# Altium schematic sheet X7A15T-Fabric.SchDoc: X7A15T-Fabric
size A3; Organization: Semi-ATE; SheetNumber: 4; SheetTotal: 7; Date: JUN 2020; ApprovedBy: Hören; CheckedBy: Mörz; Author: Hören; DrawnBy: Rudziński; Engineer: Hören
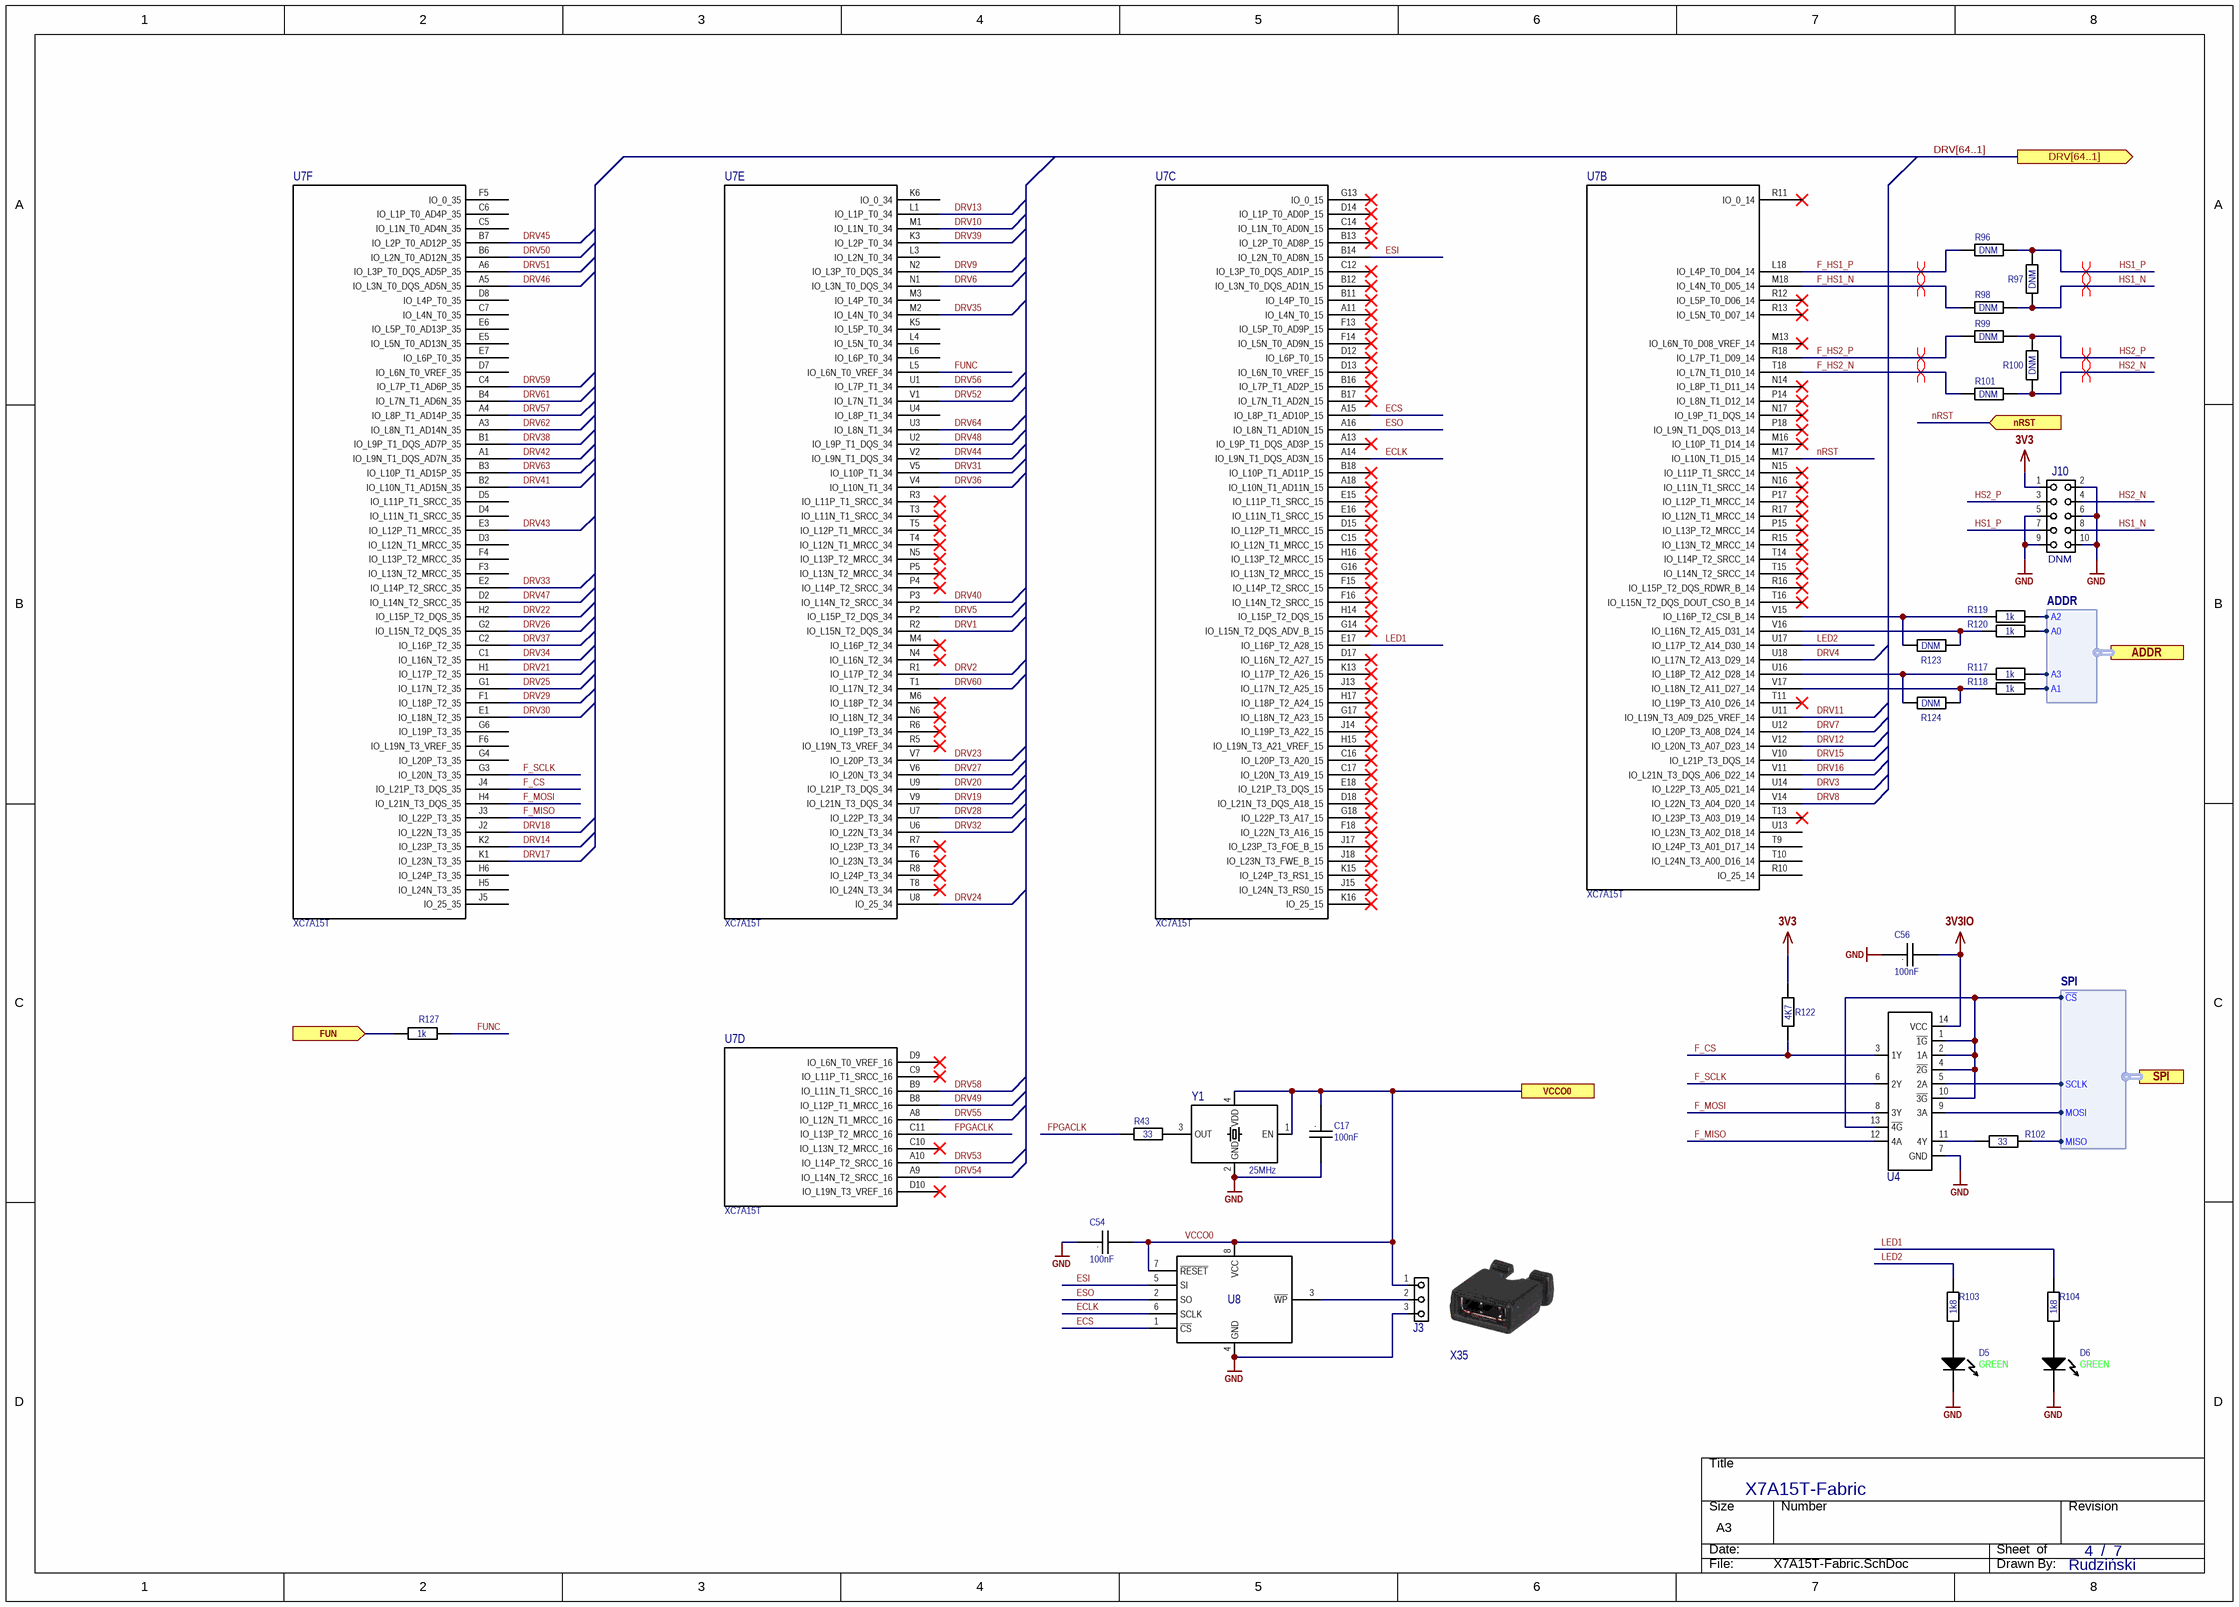
[diagram p0: X7A15T-Fabric.SchDoc]

## Parts
C17  value 100nF  [C0402 Reflow]  (hidden comment: C)
C54  value 100nF  [C0402 Reflow]  (hidden comment: C)
C56  value 100nF  [C0402 Reflow]  (hidden comment: C)
D5  Color: GREEN  [L0603G]  (hidden comment: D)
D6  Color: GREEN  [L0603G]  (hidden comment: D)
J3  J  [Header 100mil 3x1]  (value not drawn)
J10  NicName: DNM  [Header 100mil 5x2]  (hidden comment: J)  (no BOM)
R43  value 33  [R0402 Reflow]  (hidden comment: R)
R96  value DNM  [R0402 Reflow]  (hidden comment: R)  (no BOM)
R97  value DNM  [R0402 Reflow]  (hidden comment: R)  (no BOM)
R98  value DNM  [R0402 Reflow]  (hidden comment: R)  (no BOM)
R99  value DNM  [R0402 Reflow]  (hidden comment: R)  (no BOM)
R100  value DNM  [R0402 Reflow]  (hidden comment: R)  (no BOM)
R101  value DNM  [R0402 Reflow]  (hidden comment: R)  (no BOM)
R102  value 33  [R0402 Reflow]  (hidden comment: R)
R103  value 1k8  [R0603 Reflow]  (hidden comment: R)
R104  value 1k8  [R0603 Reflow]  (hidden comment: R)
R117  value 1k  [R0402 Reflow]  (hidden comment: R)
R118  value 1k  [R0402 Reflow]  (hidden comment: R)
R119  value 1k  [R0402 Reflow]  (hidden comment: R)
R120  value 1k  [R0402 Reflow]  (hidden comment: R)
R122  value 4K7  [R0402 Reflow]  (hidden comment: R)
R123  value DNM  [R0402 Reflow]  (hidden comment: R)  (no BOM)
R124  value DNM  [R0402 Reflow]  (hidden comment: R)  (no BOM)
R127  value 1k  [R0402 Reflow]  (hidden comment: R)
U4  U  [TSSOP14]  (value not drawn)
U7  NicName: XC7A15T  [XC7A15T-1CSG324C]  (hidden comment: U)  (parts B,C,D,E,F of 8)
U8  U  [SOIC8 (R-8)]  (value not drawn)
X35  X  (value not drawn)
Y1  Frequency: 25MHz  [4SMD]  (hidden comment: Y)

## Ports
ADDR (harness ADDR), DRV[64..1] (out), FUN (in), nRST (in), SPI (harness SPI), VCCO0

## Harnesses
SPI: MISO, MOSI, SCLK, ~{CS}
ADDR: A3, A2, A1, A0

## Nets
3V3: J10.1 R122.2
3V3IO: C56.2 U4.14(VCC)
GND: C17.2 C54.1 C56.1 D5.2(Cathode) D6.2(Cathode) J3.3 J10.2 J10.5 J10.6 J10.9 J10.10 U4.7(GND) U8.4(GND) Y1.2(GND)
DRV1: U7.R2(IO_L15N_T2_DQS_34)
DRV2: U7.R1(IO_L17P_T2_34)
DRV3: U7.U14(IO_L22P_T3_A05_D21_14)
DRV4: U7.U18(IO_L17N_T2_A13_D29_14)
DRV5: U7.P2(IO_L15P_T2_DQS_34)
DRV6: U7.N1(IO_L3N_T0_DQS_34)
DRV7: U7.U12(IO_L20P_T3_A08_D24_14)
DRV8: U7.V14(IO_L22N_T3_A04_D20_14)
DRV9: U7.N2(IO_L3P_T0_DQS_34)
DRV10: U7.M1(IO_L1N_T0_34)
DRV11: U7.U11(IO_L19N_T3_A09_D25_VREF_14)
DRV12: U7.V12(IO_L20N_T3_A07_D23_14)
DRV13: U7.L1(IO_L1P_T0_34)
DRV14: U7.K2(IO_L23P_T3_35)
DRV15: U7.V10(IO_L21P_T3_DQS_14)
DRV16: U7.V11(IO_L21N_T3_DQS_A06_D22_14)
DRV17: U7.K1(IO_L23N_T3_35)
DRV18: U7.J2(IO_L22N_T3_35)
DRV19: U7.V9(IO_L21N_T3_DQS_34)
DRV20: U7.U9(IO_L21P_T3_DQS_34)
DRV21: U7.H1(IO_L17P_T2_35)
DRV22: U7.H2(IO_L15P_T2_DQS_35)
DRV23: U7.V7(IO_L20P_T3_34)
DRV24: U7.U8(IO_25_34)
DRV25: U7.G1(IO_L17N_T2_35)
DRV26: U7.G2(IO_L15N_T2_DQS_35)
DRV27: U7.V6(IO_L20N_T3_34)
DRV28: U7.U7(IO_L22P_T3_34)
DRV29: U7.F1(IO_L18P_T2_35)
DRV30: U7.E1(IO_L18N_T2_35)
DRV31: U7.V5(IO_L10P_T1_34)
DRV32: U7.U6(IO_L22N_T3_34)
DRV33: U7.E2(IO_L14P_T2_SRCC_35)
DRV34: U7.C1(IO_L16N_T2_35)
DRV35: U7.M2(IO_L4N_T0_34)
DRV36: U7.V4(IO_L10N_T1_34)
DRV37: U7.C2(IO_L16P_T2_35)
DRV38: U7.B1(IO_L9P_T1_DQS_AD7P_35)
DRV39: U7.K3(IO_L2P_T0_34)
DRV40: U7.P3(IO_L14N_T2_SRCC_34)
DRV41: U7.B2(IO_L10N_T1_AD15N_35)
DRV42: U7.A1(IO_L9N_T1_DQS_AD7N_35)
DRV43: U7.E3(IO_L12P_T1_MRCC_35)
DRV44: U7.V2(IO_L9N_T1_DQS_34)
DRV45: U7.B7(IO_L2P_T0_AD12P_35)
DRV46: U7.A5(IO_L3N_T0_DQS_AD5N_35)
DRV47: U7.D2(IO_L14N_T2_SRCC_35)
DRV48: U7.U2(IO_L9P_T1_DQS_34)
DRV49: U7.B8(IO_L12P_T1_MRCC_16)
DRV50: U7.B6(IO_L2N_T0_AD12N_35)
DRV51: U7.A6(IO_L3P_T0_DQS_AD5P_35)
DRV52: U7.V1(IO_L7N_T1_34)
DRV53: U7.A10(IO_L14P_T2_SRCC_16)
DRV54: U7.A9(IO_L14N_T2_SRCC_16)
DRV55: U7.A8(IO_L12N_T1_MRCC_16)
DRV56: U7.U1(IO_L7P_T1_34)
DRV57: U7.A4(IO_L8P_T1_AD14P_35)
DRV58: U7.B9(IO_L11N_T1_SRCC_16)
DRV59: U7.C4(IO_L7P_T1_AD6P_35)
DRV60: U7.T1(IO_L17N_T2_34)
DRV61: U7.B4(IO_L7N_T1_AD6N_35)
DRV62: U7.A3(IO_L8N_T1_AD14N_35)
DRV63: U7.B3(IO_L10P_T1_AD15P_35)
DRV64: U7.U3(IO_L8N_T1_34)
ECLK: U7.A14(IO_L9N_T1_DQS_AD3N_15) U8.6(SCLK)
ECS: U7.A15(IO_L8P_T1_AD10P_15) U8.1(~{CS})
ESI: U7.B14(IO_L2N_T0_AD8N_15) U8.5(SI)
ESO: U7.A16(IO_L8N_T1_AD10N_15) U8.2(SO)
F_CS: R122.1 U4.3(1Y) U7.J4(IO_L21P_T3_DQS_35)
F_HS1_N: R98.1 U7.M18(IO_L4N_T0_D05_14)
F_HS1_P: R96.1 U7.L18(IO_L4P_T0_D04_14)
F_HS2_N: R101.1 U7.T18(IO_L7N_T1_D10_14)
F_HS2_P: R99.1 U7.R18(IO_L7P_T1_D09_14)
F_MISO: U4.12(4A) U7.J3(IO_L22P_T3_35)
F_MOSI: U4.8(3Y) U7.H4(IO_L21N_T3_DQS_35)
F_SCLK: U4.6(2Y) U7.G3(IO_L20N_T3_35)
FPGACLK: R43.2 U7.C11(IO_L13P_T2_MRCC_16)
FUN: R127.1 ; port FUN
FUNC: R127.2 U7.L5(IO_L6N_T0_VREF_34)
HS1_N: J10.8 R97.1 R98.2
HS1_P: J10.7 R96.2 R97.2
HS2_N: J10.4 R100.1 R101.2
HS2_P: J10.3 R99.2 R100.2
LED1: R104.2 U7.E17(IO_L16P_T2_A28_15)
LED2: R103.2 U7.U17(IO_L17P_T2_A14_D30_14)
nRST: U7.M17(IO_L10N_T1_D15_14) ; port nRST
VCCO0: C17.1 C54.2 J3.1 U8.7(~{RESET}) U8.8(VCC) Y1.1(EN) Y1.4(VDD) ; port VCCO0
NetD5_1: D5.1(Anode) R103.1
NetD6_1: D6.1(Anode) R104.1
NetJ3_2: J3.2 U8.3(~{WP})
NetR43_1: R43.1 Y1.3(OUT)
NetR102_1: R102.1 ; port SPI.MISO
NetR102_2: R102.2 U4.11(4Y)
NetR117_1: R117.1 R124.1 U7.U16(IO_L18P_T2_A12_D28_14)
NetR117_2: R117.2 ; port ADDR.A3
NetR118_1: R118.1 R124.2 U7.V17(IO_L18N_T2_A11_D27_14)
NetR118_2: R118.2 ; port ADDR.A1
NetR119_1: R119.1 R123.1 U7.V15(IO_L16P_T2_CSI_B_14)
NetR119_2: R119.2 ; port ADDR.A2
NetR120_1: R120.1 R123.2 U7.V16(IO_L16N_T2_A15_D31_14)
NetR120_2: R120.2 ; port ADDR.A0
NetU4_1: U4.1(~{1G}) U4.2(1A) U4.4(~{2G}) U4.10(~{3G}) U4.13(~{4G}) ; port SPI.~{CS}
NetU4_5: U4.5(2A) ; port SPI.SCLK
NetU4_9: U4.9(3A) ; port SPI.MOSI

Not connected (* = marked no-connect by the designer): U7 A11(IO_L4N_T0_15)* A13(IO_L9P_T1_DQS_AD3P_15)* A18(IO_L10N_T1_AD11N_15)* B11(IO_L4P_T0_15)* B12(IO_L3N_T0_DQS_AD1N_15)* B13(IO_L2P_T0_AD8P_15)* B16(IO_L7P_T1_AD2P_15)* B17(IO_L7N_T1_AD2N_15)* B18(IO_L10P_T1_AD11P_15)* C5(IO_L1N_T0_AD4N_35) C6(IO_L1P_T0_AD4P_35) C7(IO_L4N_T0_35) C9(IO_L11P_T1_SRCC_16)* C10(IO_L13N_T2_MRCC_16)* C12(IO_L3P_T0_DQS_AD1P_15)* C14(IO_L1N_T0_AD0N_15)* C15(IO_L12N_T1_MRCC_15)* C16(IO_L20P_T3_A20_15)* C17(IO_L20N_T3_A19_15)* D3(IO_L12N_T1_MRCC_35) D4(IO_L11N_T1_SRCC_35) D5(IO_L11P_T1_SRCC_35) D7(IO_L6N_T0_VREF_35) D8(IO_L4P_T0_35) D9(IO_L6N_T0_VREF_16)* D10(IO_L19N_T3_VREF_16)* D12(IO_L6P_T0_15)* D13(IO_L6N_T0_VREF_15)* D14(IO_L1P_T0_AD0P_15)* D15(IO_L12P_T1_MRCC_15)* D17(IO_L16N_T2_A27_15)* D18(IO_L21N_T3_DQS_A18_15)* E5(IO_L5N_T0_AD13N_35) E6(IO_L5P_T0_AD13P_35) E7(IO_L6P_T0_35) E15(IO_L11P_T1_SRCC_15)* E16(IO_L11N_T1_SRCC_15)* E18(IO_L21P_T3_DQS_15)* F3(IO_L13N_T2_MRCC_35) F4(IO_L13P_T2_MRCC_35) F5(IO_0_35) F6(IO_L19N_T3_VREF_35) F13(IO_L5P_T0_AD9P_15)* F14(IO_L5N_T0_AD9N_15)* F15(IO_L14P_T2_SRCC_15)* F16(IO_L14N_T2_SRCC_15)* F18(IO_L22N_T3_A16_15)* G4(IO_L20P_T3_35) G6(IO_L19P_T3_35) G13(IO_0_15)* G14(IO_L15N_T2_DQS_ADV_B_15)* G16(IO_L13N_T2_MRCC_15)* G17(IO_L18N_T2_A23_15)* G18(IO_L22P_T3_A17_15)* H5(IO_L24N_T3_35) H6(IO_L24P_T3_35) H14(IO_L15P_T2_DQS_15)* H15(IO_L19N_T3_A21_VREF_15)* H16(IO_L13P_T2_MRCC_15)* H17(IO_L18P_T2_A24_15)* J5(IO_25_35) J13(IO_L17N_T2_A25_15)* J14(IO_L19P_T3_A22_15)* J15(IO_L24N_T3_RS0_15)* J17(IO_L23P_T3_FOE_B_15)* J18(IO_L23N_T3_FWE_B_15)* K5(IO_L5P_T0_34) K6(IO_0_34) K13(IO_L17P_T2_A26_15)* K15(IO_L24P_T3_RS1_15)* K16(IO_25_15)* L3(IO_L2N_T0_34) L4(IO_L5N_T0_34) L6(IO_L6P_T0_34) M3(IO_L4P_T0_34) M4(IO_L16P_T2_34)* M6(IO_L18P_T2_34)* M13(IO_L6N_T0_D08_VREF_14)* M16(IO_L10P_T1_D14_14)* N4(IO_L16N_T2_34)* N5(IO_L13P_T2_MRCC_34)* N6(IO_L18N_T2_34)* N14(IO_L8P_T1_D11_14)* N15(IO_L11P_T1_SRCC_14)* N16(IO_L11N_T1_SRCC_14)* N17(IO_L9P_T1_DQS_14)* P4(IO_L14P_T2_SRCC_34)* P5(IO_L13N_T2_MRCC_34)* P14(IO_L8N_T1_D12_14)* P15(IO_L13P_T2_MRCC_14)* P17(IO_L12P_T1_MRCC_14)* P18(IO_L9N_T1_DQS_D13_14)* R3(IO_L11P_T1_SRCC_34)* R5(IO_L19N_T3_VREF_34)* R6(IO_L19P_T3_34)* R7(IO_L23P_T3_34)* R8(IO_L24P_T3_34)* R10(IO_25_14) R11(IO_0_14)* R12(IO_L5P_T0_D06_14)* R13(IO_L5N_T0_D07_14)* R15(IO_L13N_T2_MRCC_14)* R16(IO_L15P_T2_DQS_RDWR_B_14)* R17(IO_L12N_T1_MRCC_14)* T3(IO_L11N_T1_SRCC_34)* T4(IO_L12N_T1_MRCC_34)* T5(IO_L12P_T1_MRCC_34)* T6(IO_L23N_T3_34)* T8(IO_L24N_T3_34)* T9(IO_L24P_T3_A01_D17_14) T10(IO_L24N_T3_A00_D16_14) T11(IO_L19P_T3_A10_D26_14)* T13(IO_L23P_T3_A03_D19_14)* T14(IO_L14P_T2_SRCC_14)* T15(IO_L14N_T2_SRCC_14)* T16(IO_L15N_T2_DQS_DOUT_CSO_B_14)* U4(IO_L8P_T1_34) U13(IO_L23N_T3_A02_D18_14)

## Buses and harness runs
bus DRV[64..1] = port DRV[64..1]

## Layout directives
differential pair; net class GENHS_DP: F_HS1_N, F_HS1_P, F_HS2_N, F_HS2_P, HS1_N, HS1_P, HS2_N, HS2_P

## Notes on the sheet
- /
- designed by
- reviewed by
- last drawn by
- Project:
- Schematic:
- last printed
- DIN-A3 L
- sheets
- of
- File:
- (in symbol C) .

## Library data of the parts
C17 C54 C56 = C: CAP CER 0.1UF 25V X7R 0402; 04. Manufacturer: Yageo; 07. Manufacturer  Part Number: CC0402KRX7R8BB104; Tolerance: ±5%; Voltage Rating: 16V; 03. Unit Price: 0.09; 13. Created Date/Name: AUG2018/Hören; Type: X7R; ComponentLink1Description: Info; ComponentLink1URL: https://www.digikey.de/product-detail/en/kemet/C0402C104J4RACTU/399-7761-6-ND/3472292; 02. Distributor Part Number: 311-2077-6-ND; 09. Operating Temperature: -55°C ~ 125°C; 11. RoHS: YES; 01. Distributor: DigiKey; ComponentLink2Description: DataSheet; ComponentLink2URL: https://content.kemet.com/datasheets/KEM_C1002_X7R_SMD.pdf; Package: 0402
D5 D6 = LED: LED GREEN DIFFUSED 0603 SMD; 04. Manufacturer: OSRAM Opto Semiconductors Inc.; 07. Manufacturer  Part Number: LG L29K-G2J1-24-Z; Vf: 1.7V; If: 2mA; Wave Length: 570nm; Viewing Angle: 160°; 03. Unit Price: 0.4; 13. Created Date/Name: AUG2018/Hören; ComponentLink1Description: Info; ComponentLink1URL: https://www.digikey.de/products/en?keywords=475-2709-6-ND; ComponentLink2Description: DataSheet; ComponentLink2URL: https://www.digikey.de/products/en?keywords=475-2709-6-ND; 02. Distributor Part Number: 475-2709-6-ND; 11. RoHS: YES; 01. Distributor: DigiKey
J3 = Header 3Pins 100mil: CONN HEADER VERT 3POS 2.54MM; 04. Manufacturer: Samtec Inc.; 07. Manufacturer  Part Number: HMTSW-103-07-G-S-240; 03. Unit Price: 0.25; 13. Created Date/Name: AUG2018/Hören; 01. Distributor: Samtec Inc.; 02. Distributor Part Number: HMTSW-103-07-G-S-240; 11. RoHS: YES; ComponentLink1Description: Info; ComponentLink1URL: https://www.samtec.com/products/hmtsw-103-07-g-s-240; ComponentLink2Description: DataSheet; ComponentLink2URL: http://suddendocs.samtec.com/catalog_english/hmtsw.pdf
J10 = Header 5x2Pins 100mil: 04. Manufacturer: Samtec Inc.; 07. Manufacturer  Part Number: HMTSW-103-07-G-S-240; 03. Unit Price: 0.25; 13. Created Date/Name: AUG2018/Hören; 01. Distributor: Samtec Inc.; 02. Distributor Part Number: HMTSW-103-07-G-S-240; 11. RoHS: YES; ComponentLink1Description: Info; ComponentLink1URL: https://www.samtec.com/products/hmtsw-103-07-g-s-240; ComponentLink2Description: DataSheet; ComponentLink2URL: http://suddendocs.samtec.com/catalog_english/hmtsw.pdf
R43 R102 = R: RES SMD 33 OHM 1% 1/16W 0402; 04. Manufacturer: Yageo; 07. Manufacturer  Part Number: RC0402FR-0733RL; 03. Unit Price: 0.09; 13. Created Date/Name: AUG2018/Hören; Power Rating: 63mW; Tolerance: ±1%; ComponentLink1URL: https://www.digikey.de/products/en?keywords=311-33.0LRDKR-ND; ComponentLink1Description: Info; 02. Distributor Part Number: 311-33.0LRDKR-ND; 09. Operating Temperature: -55°C ~ 155°C; 11. RoHS: YES; 01. Distributor: DigiKey; ComponentLink2Description: DataSheet; Type: Thick Film; Package: 0402
R96-R101 = R_19: RES SMD 33 OHM 1% 1/16W 0402; 04. Manufacturer: Yageo; 07. Manufacturer  Part Number: RC0402FR-0733RL; 03. Unit Price: 0.09; 13. Created Date/Name: AUG2018/Hören; Power Rating: 63mW; Tolerance: ±1%; ComponentLink1URL: https://www.digikey.de/products/en?keywords=311-33.0LRDKR-ND; ComponentLink1Description: Info; 02. Distributor Part Number: 311-33.0LRDKR-ND; 09. Operating Temperature: -55°C ~ 155°C; 11. RoHS: YES; 01. Distributor: DigiKey; ComponentLink2Description: DataSheet; Type: Thick Film; Package: 0402
R103 R104 = R: RES SMD 1.8K OHM 1% 1/16W 0402; 04. Manufacturer: Yageo; 07. Manufacturer  Part Number: RC0402FR-071K8L; 03. Unit Price: 0.09; 13. Created Date/Name: AUG2018/Hören; Power Rating: 63mW; Tolerance: ±1%; ComponentLink1URL: https://www.digikey.de/product-detail/en/yageo/RC0402FR-071K65L/YAG3043DKR-ND/5282914; ComponentLink1Description: Info; 02. Distributor Part Number: 311-1.80KLRCT-ND; 09. Operating Temperature: -55°C ~ 155°C; 11. RoHS: YES; 01. Distributor: DigiKey; ComponentLink2Description: DataSheet; Type: Thick Film; Package: 0402
R117-R120 R127 = R: RES SMD 1K OHM 1% 1/16W 0402; 04. Manufacturer: Yageo; 07. Manufacturer  Part Number: RC0402FR-071KP; 03. Unit Price: 0.09; 13. Created Date/Name: AUG2018/Hören; Tolerance: ±1%; ComponentLink1URL: *; ComponentLink1Description: Info; 02. Distributor Part Number: YAG1254CT-ND; 09. Operating Temperature: -xx..+yy°C; 11. RoHS: ???; 01. Distributor: DigiKey; ComponentLink2Description: DataSheet; Package: *
R122-R124 = R: RES SMD 4.7K OHM 1% 1/16W 0402; 04. Manufacturer: Yageo; 07. Manufacturer  Part Number: RC0402FR-074K7L; 03. Unit Price: 0.09; 13. Created Date/Name: AUG2018/Hören; Power Rating: 63mW; Tolerance: ±1%; ComponentLink1URL: https://www.digikey.de/products/en?keywords=311-4.7KLRDKR-ND; ComponentLink1Description: Info; 02. Distributor Part Number: 311-4.7KLRDKR-ND; 09. Operating Temperature: -55°C ~ 155°C; 11. RoHS: YES; 01. Distributor: DigiKey; ComponentLink2Description: DataSheet; Type: Thick Film; Package: 0402
U4 = 74LCX125: IC BUF NON-INVERT 3.6V 14TSSOP; 04. Manufacturer: STMicroelectronics; 07. Manufacturer  Part Number: 74LCX125YTTR; 03. Unit Price: 0.51; 01. Distributor: DigiKey; 02. Distributor Part Number: 497-13204-2-ND; 11. RoHS: YES; ComponentLink1Description: Info; ComponentLink2Description: DataSheet; Package: TSSOP14
U7 = XC7A15T-CS324: XC7A15T-1CSG324C; MFR: XILINX; POPULATED: yes; 03. Unit Price: 20.65; MFR-PN: XC7A15T-CS324; 04. Manufacturer: XILINX; 07. Manufacturer  Part Number: XC7A15T-1CSG324C; 01. Distributor: Avnet; 02. Distributor Part Number: XC7A15T-1CSG324C; 09. Operating Temperature: 0°C ~ 85°C (TJ); 11. RoHS: YES; ComponentLink4Description: Info; ComponentLink4URL: https://www.digikey.de/products/en?keywords=XC7A15T-1CSG324C; ComponentLink5Description: DataSheet; ComponentLink5URL: https://www.xilinx.com/support/documentation/data_sheets/ds181_Artix_7_Data_Sheet.pdf; ComponentLink6Description: NXP; ComponentLink6URL: https://www.nxp.com/part/MK20DN512VMD10
U8 = MX25R3235FM1IH0: IC FLASH 32M SPI 80MHZ 8SOP; 04. Manufacturer: Macronix; 03. Unit Price: 0.79; 13. Created Date/Name: AUG 2018 / Hören; 01. Distributor: DigiKey; 02. Distributor Part Number: 1092-1175-ND; 07. Manufacturer  Part Number: MX25R3235FM1IH0; ComponentLink1Description: Info; ComponentLink1URL: https://www.digikey.de/product-detail/en/macronix/MX25R3235FM1IH0/1092-1175-ND/5957736; ComponentLink2Description: DataSheet; ComponentLink2URL: https://www.macronix.com/Lists/Datasheet/Attachments/7534/MX25R3235F%2c%20Wide%20Range%2c%2032Mb%2c%20v1.6.pdf
X35 = Jumper: CONN JUMPER SHORTING .100" GOLD; 04. Manufacturer: Sullins Connector Solutions; 07. Manufacturer  Part Number: QPC02SXGN-RC; 03. Unit Price: 0.09; 13. Created Date/Name: AUG2018/Hören; 01. Distributor: DigiKey; 02. Distributor Part Number: S9337-ND; 09. Operating Temperature: -xx..+yy°C; 11. RoHS: ???; ComponentLink1Description: Info; ComponentLink1URL: https://www.digikey.de/product-detail/en/sullins-connector-solutions/QPC02SXGN-RC/S9337-ND/2618262; ComponentLink2Description: DataSheet
Y1 = ASE-25.000MHZ-LC-T: XTAL OSC XO 25.0000MHZ CMOS SMD; 04. Manufacturer: Abracon LLC; 03. Unit Price: 1.46; 13. Created Date/Name: AUG 2018 / Hören; 01. Distributor: DigiKey; 02. Distributor Part Number: 535-9568-1-ND; 07. Manufacturer  Part Number: ASE-25.000MHZ-LC-T; 11. RoHS: YES; ComponentLink1Description: Info; ComponentLink1URL: https://www.digikey.de/products/en?keywords=535-9568-1-ND; ComponentLink2Description: DataSheet; Package: 4SMD